# EAGLE design 89c2051-lk-ps2 (EAGLE 4.16)
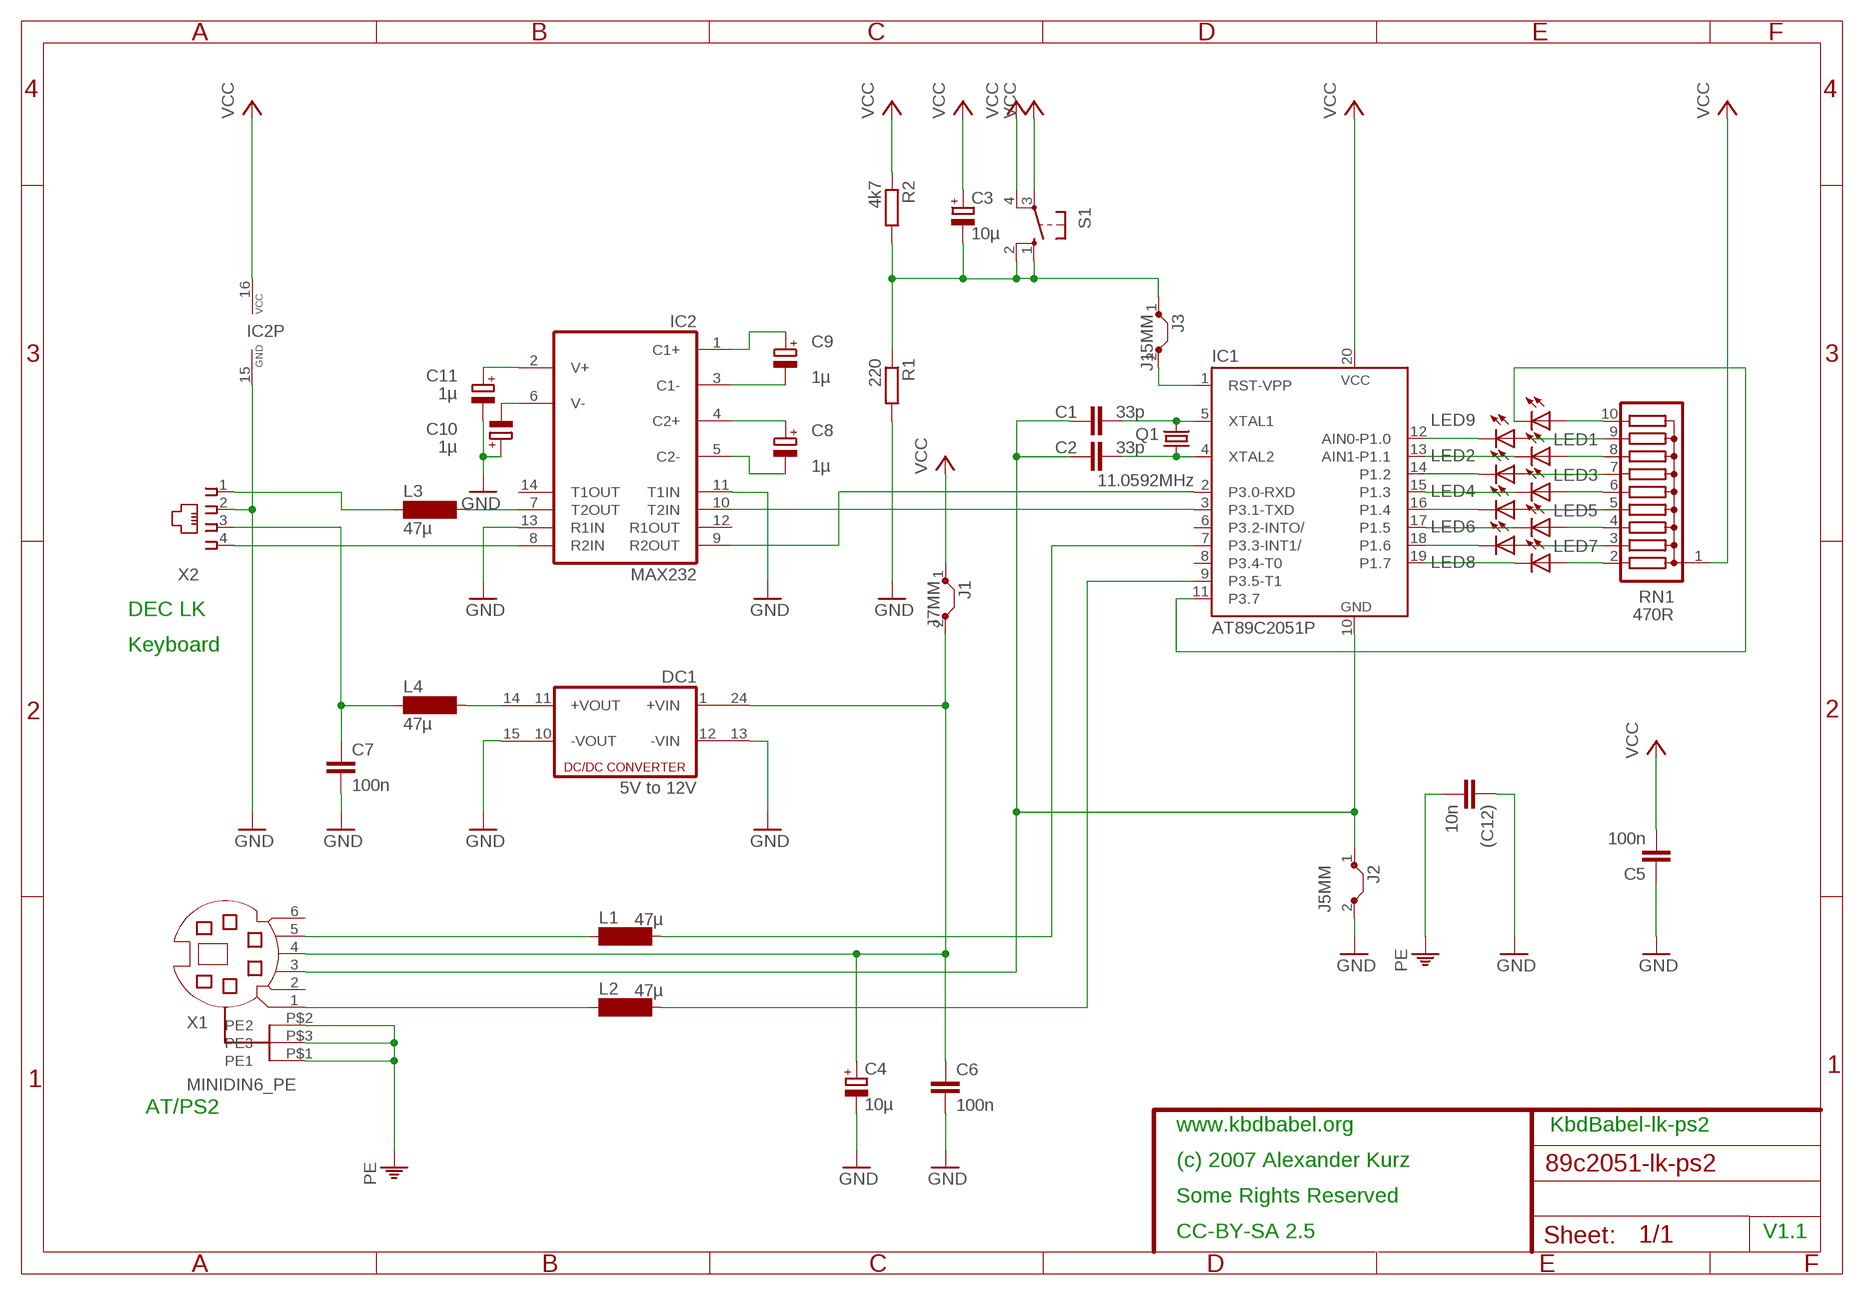
[diagram p0: schematic, sheet 1]

## Parts
(C12)  10n  C-EU025_050-025X075  [C025_050-025X075]
C1  33p  C-EU025-030X050  [C025-030X050]
C2  33p  C-EU025-030X050  [C025-030X050]
C3  10µ  CPOL-EUE2-5  [E2-5]
C4  10µ  CPOL-EUE2-5  [E2-5]
C5  100n  C-EU025_050-025X075  [C025_050-025X075]
C6  100n  C-EU025_050-025X075  [C025_050-025X075]
C7  100n  C-EU025_050-025X075  [C025_050-025X075]
C8  1µ  CPOL-EUE2-5  [E2-5]
C9  1µ  CPOL-EUE2-5  [E2-5]
C10  1µ  CPOL-EUE2-5  [E2-5]
C11  1µ  CPOL-EUE5-5  [E5-5]
DC1  5V to 12V  DC213R  [CMK]
IC1  AT89C2051P  [DIL20]
IC2  MAX232  [DIL16]
J1  J7MM  [07]
J2  J5MM  [05]
J3  J15MM  [15]
L1  47µ  SD75  [SD75]
L2  47µ  SD75  [SD75]
L3  47µ  SD75  [SD75]
L4  47µ  SD75  [SD75]
LED1  LEDSQR2X5  [LED2X5]
LED2  LEDSQR2X5  [LED2X5]
LED3  LEDSQR2X5  [LED2X5]
LED4  LEDSQR2X5  [LED2X5]
LED5  LEDSQR2X5  [LED2X5]
LED6  LEDSQR2X5  [LED2X5]
LED7  LEDSQR2X5  [LED2X5]
LED8  LEDSQR2X5  [LED2X5]
LED9  LEDSQR2X5  [LED2X5]
Q1  11.0592MHz  CRYSTALHC49U70  [HC49U70]
R1  220  R-EU_0204/7  [0204/7]
R2  4k7  R-EU_0204/7  [0204/7]
RN1  470R  G09R  [SIL10]
S1  10-XX  [B3F-10XX]
X1  MINIDIN6_PE  [MINIDIN6_PE]
X2  520249-2  [520249-2]

## Nets
GND: (C12).1 C4.- C5.1 C6.2 C7.2 C10.+ C11.- DC1.13(-VIN1) DC1.15(-VOUT1) IC2.11(T1IN) IC2.13(R1IN) IC2.15(GND) J2.2 R1.2 X2.2
GND_2: C1.1 C2.2 IC1.10(GND) J2.1 X1.3
N$1: C1.2 IC1.5(XTAL1) Q1.2
N$2: C2.1 IC1.4(XTAL2) Q1.1
N$3: IC2.7(T2OUT) L3.2
N$4: LED1.A RN1.9
N$5: IC1.17(P1.5) LED6.K(C)
N$6: IC1.2(P3.0-RXD) IC2.9(R2OUT)
N$7: IC2.8(R2IN) X2.4
N$8: IC1.12(AIN0-P1.0) LED1.K(C)
N$9: L3.1 X2.1
N$11: L2.1 X1.1
N$12: IC1.9(P3.5-T1) L2.2
N$13: IC1.13(AIN1-P1.1) LED2.K(C)
N$14: LED3.A RN1.7
N$15: IC1.15(P1.3) LED4.K(C)
N$16: LED5.A RN1.5
N$17: LED2.A RN1.8
N$18: LED4.A RN1.6
N$19: LED6.A RN1.4
N$20: IC1.18(P1.6) LED7.K(C)
N$21: LED8.A RN1.2
N$22: LED7.A RN1.3
N$23: IC1.19(P1.7) LED8.K(C)
N$24: IC1.16(P1.4) LED5.K(C)
N$25: IC1.14(P1.2) LED3.K(C)
N$26: DC1.14(+VOUT1) L4.2
N$27: LED9.A RN1.10
N$28: IC1.11(P3.7) LED9.K(C)
N$29: C7.1 L4.1 X2.3
N$30: C8.+ IC2.4(C2+)
N$31: C8.- IC2.5(C2-)
N$33: C9.- IC2.3(C1-)
N$34: C9.+ IC2.1(C1+)
N$35: C10.- IC2.6(V-)
N$36: C11.+ IC2.2(V+)
N$39: IC1.3(P3.1-TXD) IC2.10(T2IN)
N$41: IC1.7(P3.3-INT1/) L1.2
N$42: L1.1 X1.5
PE: (C12).2 X1.P$1(PE1) X1.P$2(PE2) X1.P$3(PE3)
RST: C3.- J3.1 R1.1 R2.2 S1.1(S) S1.2(S1)
RST_2: IC1.1(RST-VPP) J3.2
VCC: C3.+ C5.2 IC1.20(VCC) IC2.16(VCC) J1.1 R2.1 RN1.1 S1.3(P) S1.4(P1)
VCC_IN: C4.+ C6.1 DC1.24(+VIN1) J1.2 X1.4
Unconnected: DC1.1(+VIN) DC1.10(-VOUT) DC1.11(+VOUT) DC1.12(-VIN) IC1.6(P3.2-INTO/) IC1.8(P3.4-T0) IC2.12(R1OUT) IC2.14(T1OUT) X1.2 X1.6

## Notes on the sheet
- DEC LK
- Keyboard
- AT/PS2
- www.kbdbabel.org | KbdBabel-lk-ps2
- (c) 2007 Alexander Kurz
- Some Rights Reserved
- CC-BY-SA 2.5 | V1.1

## Library data of the parts
(C12) C1 C2 C5-C7 = rcl:C-EU: CAPACITOR, European symbol
C3 C4 C8-C11 = rcl:CPOL-EU: POLARIZED CAPACITOR, European symbol
DC1 = dc-dc-converter:DC213R: DC-DC CONVERTER
IC1 = atmel:AT89C2051: 80C31 MICROCONTROLLER 2 Kbytes FLASH 2.7 V
IC2 = maxim:MAX232: RS232 TRANSEIVER
J1-J3 = jumper:J: Bridge
L1-L4 = inductor-neosid:SD75: INDUCTOR nominal inductance, E12
LED1-LED9 = led:LED: LED OSRAM: - CHIPLED LG R971, LG N971, LY N971, LG Q971, LY Q971, LO R971, LY R971 LH N974, LH R974 LS Q976, LO Q976, LY Q976 LO Q996 - Hyper CHIPLED LW Q18S LB Q993, LB Q99A, LB R99A - SideLED LS A670, LO A670, LY A670, LG A670, LP A670 LB A673, LV A673, LT A673, LW A673 LH A674 LY A675 LS A676, LA A676, LO A676, LY A676, LW A676 LS A679, LY A679, LG A679 - Hyper Micro SIDELED® LS Y876, LA Y876, LO Y876, LY Y876 LT Y87S - SmartLED LW L88C, LW L88S LB L89C, LB L89S, LG L890 LS L89K, LO L89K, LY L89K LS L896, LA L896, LO L896, LY L896 - TOPLED LS T670, LO T670, LY T670, LG T670, LP T670 LSG T670, LSP T670, LSY T670, LOP T670, LYG T670 LG T671, LOG T671, LSG T671 LB T673, LV T673, LT T673, LW T673 LH T674 LS T676, LA T676, LO T676, LY T676, LB T676, LH T676, LSB T676, LW T676 LB T67C, LV T67C, LT T67C, LS T67K, LO T67K, LY T67K, LW E67C LS E67B, LA E67B, LO E67B, LY E67B, LB E67C, LV E67C, LT E67C LW T67C LS T679, LY T679, LG T679 LS T770, LO T770, LY T770, LG T770, LP T770 LB T773, LV T773, LT T773, LW T773 LH T774 LS E675, LA E675, LY E675, LS T675 LS T776, LA T776, LO T776, LY T776, LB T776 LHGB T686 LT T68C, LB T68C - Hyper Mini TOPLED® LB M676 - Mini TOPLED Santana® LG M470 LS M47K, LO M47K, LY M47K Source: http://www.osram.convergy.de - LUMILED® LXK2-PW12-R00, LXK2-PW12-S00, LXK2-PW14-U00, LXK2-PW14-V00 LXK2-PM12-R00, LXK2-PM12-S00, LXK2-PM14-U00 LXK2-PE12-Q00, LXK2-PE12-R00, LXK2-PE12-S00, LXK2-PE14-T00, LXK2-PE14-U00 LXK2-PB12-K00, LXK2-PB12-L00, LXK2-PB12-M00, LXK2-PB14-N00, LXK2-PB14-P00, LXK2-PB14-Q00 LXK2-PR12-L00, LXK2-PR12-M00, LXK2-PR14-Q00, LXK2-PR14-R00 LXK2-PD12-Q00, LXK2-PD12-R00, LXK2-PD12-S00 LXK2-PH12-R00, LXK2-PH12-S00 LXK2-PL12-P00, LXK2-PL12-Q00, LXK2-PL12-R00 Source: www.luxeon.com
Q1 = crystal:CRYSTAL: CRYSTAL
R1 R2 = rcl:R-EU_: RESISTOR, European symbol
RN1 = resistor-sil:G09R: SIL RESISTOR
S1 = switch-omron:10-XX: OMRON SWITCH
X1 = bla:MINIDIN6_PE
X2 = con-amp:520249-2: AMP connector

## Board
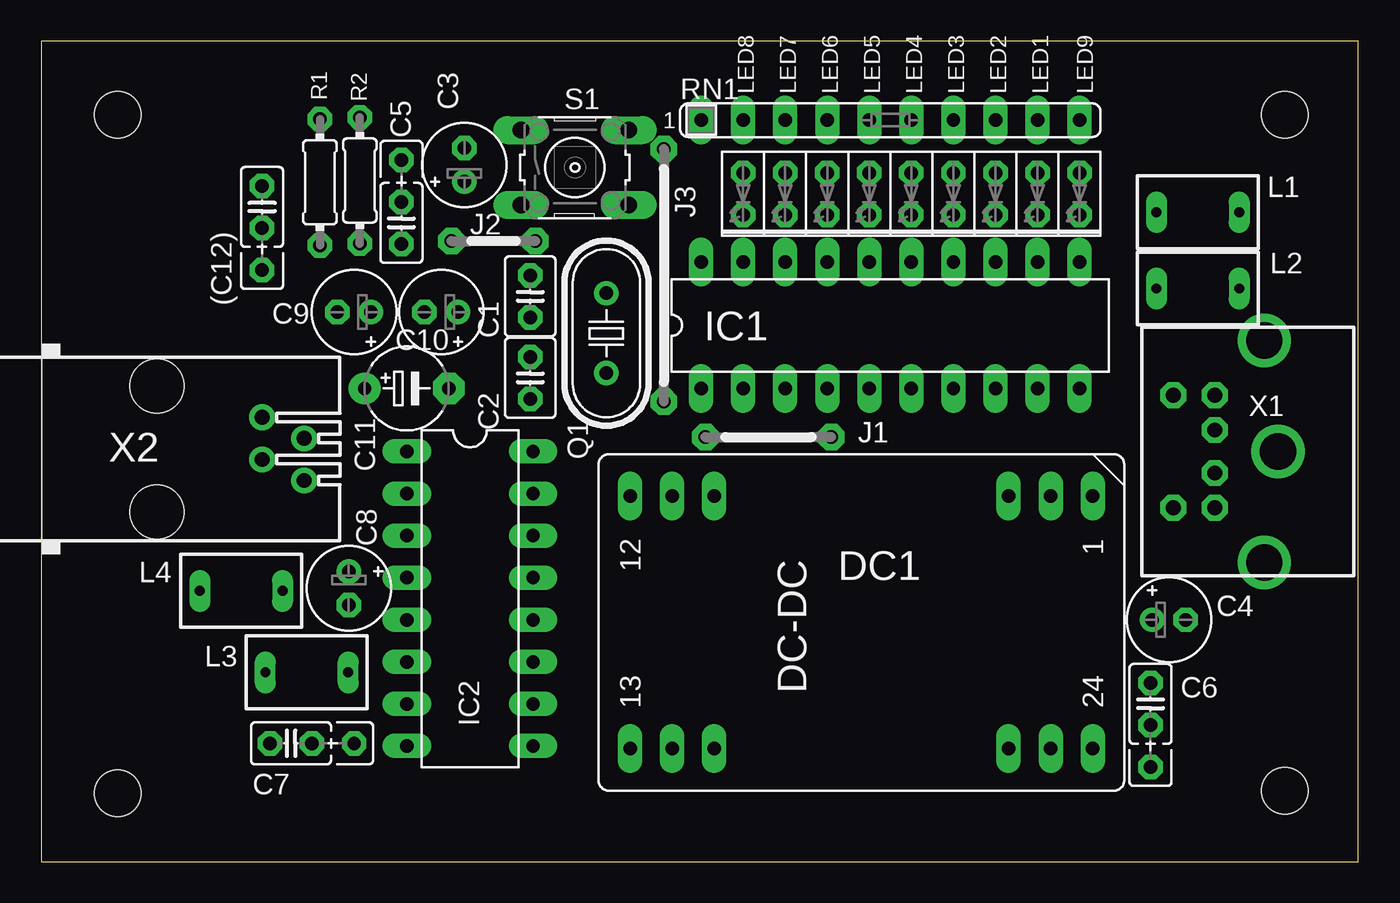
[diagram p1: board, top side]
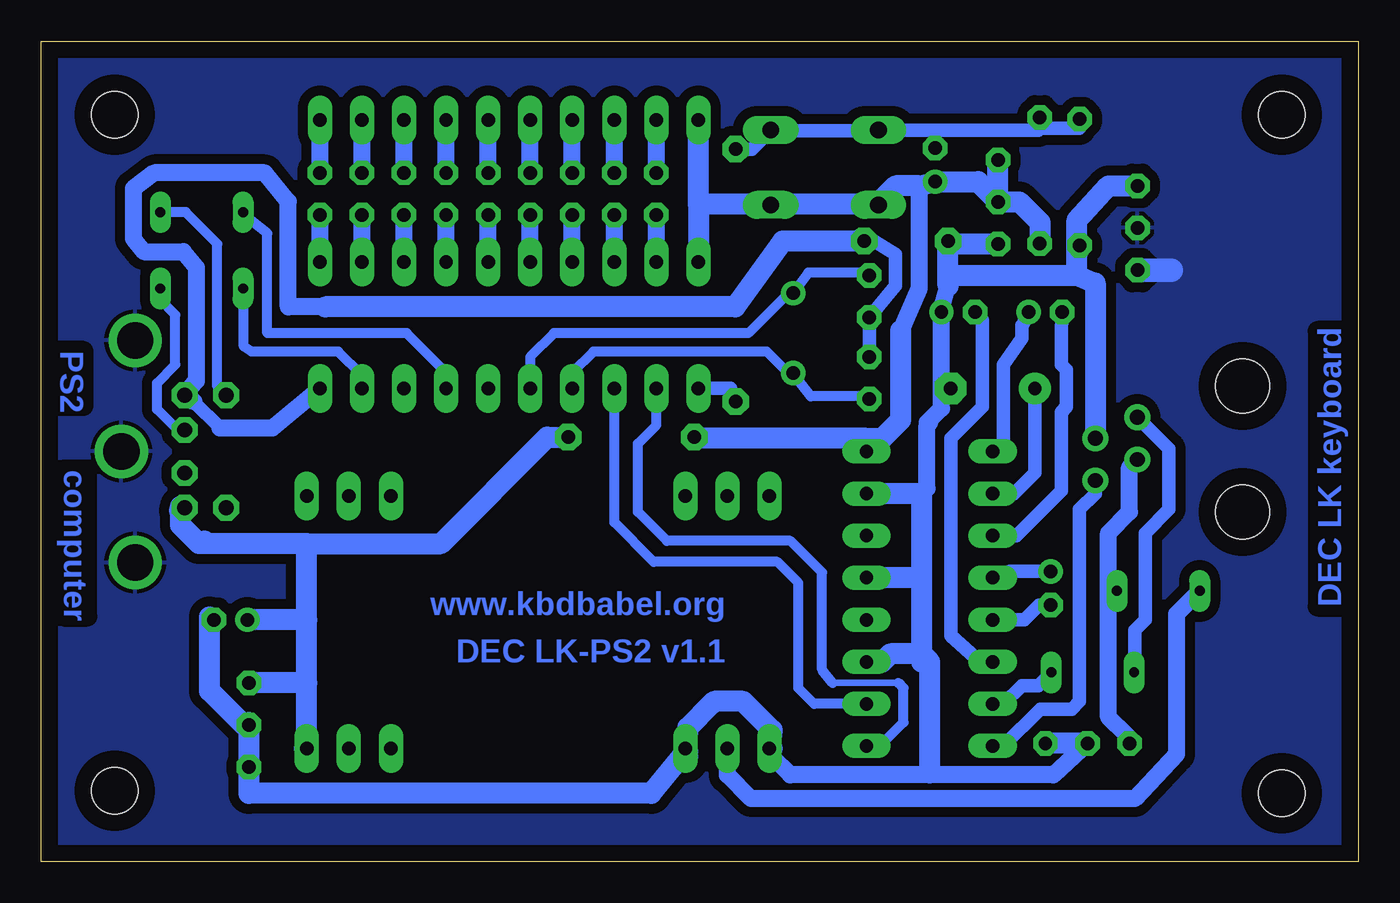
[diagram p2: board, bottom side, seen from below]

Size 79.52 x 49.52 mm. Coordinates in mm from the lower left corner, seen from the top.
Outline: 79.52,0 79.52,49.52 0,49.52 0,0 79.52,0
Copper layers (1*16): Top 0.035mm / dielectric 1.5mm / Bottom 0.035mm
Design rules "default": minimum track width 16mil, minimum drill 24mil, track to track 16mil, track to pad 16mil, pad to pad 16mil, via to via 16mil, smd to smd 16mil, copper to edge 40mil, drill to drill 8mil, minimum pad ring 13mil, minimum via ring 8mil, stop-mask expansion 4mil, vias tented up to drill 0mil, thermal gap 10mil
Holes 2.8 mm at 75.08,4.28 75.08,45.08 4.6,45.08 4.6,4.12

### Footprints (pad centres in the part's own frame; a part is rotated, then mirrored left to right if it is on the bottom)
C025_050-025X075 = drill 0.813 octagon: 1 -1.27,0; 2 1.27,0; 3 3.81,0
C025-030X050 = drill 0.813 octagon: 1 -1.27,0; 2 1.27,0
E2-5 = drill 0.813 pad 1.27 round: + -1.016,0 | drill 0.813 pad 1.27 octagon: - 1.016,0
E5-5 = drill 0.813 pad 1.905 round: + -2.54,0 | drill 0.813 pad 1.905 octagon: - 2.54,0
CMK = drill 0.813 long: 1 -7.62,13.97; 2 -7.62,11.43; 3 -7.62,8.89; 10 -7.62,-8.89; 11 -7.62,-11.43; 12 -7.62,-13.97; 13 7.62,-13.97; 14 7.62,-11.43; 15 7.62,-8.89; 22 7.62,8.89; 23 7.62,11.43; 24 7.62,13.97
DIL20 = drill 0.813 long: 1 -11.43,-3.81; 2 -8.89,-3.81; 3 -6.35,-3.81; 4 -3.81,-3.81; 5 -1.27,-3.81; 6 1.27,-3.81; 7 3.81,-3.81; 8 6.35,-3.81; 9 8.89,-3.81; 10 11.43,-3.81; 11 11.43,3.81; 12 8.89,3.81; 13 6.35,3.81; 14 3.81,3.81; 15 1.27,3.81; 16 -1.27,3.81; 17 -3.81,3.81; 18 -6.35,3.81; 19 -8.89,3.81; 20 -11.43,3.81
DIL16 = drill 0.813 long: 1 -8.89,-3.81; 2 -6.35,-3.81; 3 -3.81,-3.81; 4 -1.27,-3.81; 5 1.27,-3.81; 6 3.81,-3.81; 7 6.35,-3.81; 8 8.89,-3.81; 9 8.89,3.81; 10 6.35,3.81; 11 3.81,3.81; 12 1.27,3.81; 13 -1.27,3.81; 14 -3.81,3.81; 15 -6.35,3.81; 16 -8.89,3.81
07 = drill 0.813 pad 1.6 octagon: 1 -3.81,0; 2 3.81,0
05 = drill 0.813 pad 1.6 octagon: 1 -2.54,0; 2 2.54,0
15 = drill 0.813 pad 1.6 octagon: 1 -7.62,0; 2 7.62,0
SD75 = drill 0.6 long: 1 -2.5,0; 2 2.5,0
LED2X5 = drill 0.813 octagon: A -1.27,0; K 1.27,0
HC49U70 = drill 0.813 round: 1 -2.413,0; 2 2.413,0
0204/7 = drill 0.813 octagon: 1 -3.81,0; 2 3.81,0
SIL10 = drill 0.813 long: 1 -11.43,0; 2 -8.89,0; 3 -6.35,0; 4 -3.81,0; 5 -1.27,0; 6 1.27,0; 7 3.81,0; 8 6.35,0; 9 8.89,0; 10 11.43,0
B3F-10XX = drill 1.016 long: 1 -3.251,2.261; 2 3.251,2.261; 3 -3.251,-2.261; 4 3.251,-2.261
MINIDIN6_PE = drill 0.9 octagon: 1 1.3,2.15; 2 -1.3,2.15; 3 3.4,2.15; 4 -3.4,2.15; 5 3.4,4.65; 6 -3.4,4.65 | drill 2.2 round: P$1 0,-1.676; P$2 -6.706,-0.838; P$3 6.706,-0.838
520249-2 = drill 0.889 round: 1 -1.905,6.35; 2 -0.635,8.89; 3 0.635,6.35; 4 1.905,8.89 | hole 3.251: -3.81,0; 3.81,0

### Placement (x,y rotation side)
(C12)  13.33,39.52 270 top
C1  29.52,34.12 90 top
C2  29.52,29.2 90 top
C3  25.55,42.06 90 top
C4  68.1,14.6 0 top
C5  21.74,38.56 90 top
C6  66.99,9.52 270 top
C7  15.08,7.14 0 top
C8  18.57,16.5 270 top
C9  18.89,33.17 180 top
C10  24.15,33.17 180 top
C11  22.06,28.57 0 top
DC1  49.52,14.44 270 top
IC1  51.27,32.38 0 top
IC2  25.88,15.87 270 top
J1  43.91,25.62 0 top
J2  27.3,37.46 180 top
J3  37.59,35.39 270 top
L1  69.84,39.21 180 top
L2  69.84,34.6 180 top
L3  16.03,11.42 0 top
L4  12.06,16.34 180 top
LED1  60.16,40.32 270 top
LED2  57.62,40.32 270 top
LED3  55.08,40.32 270 top
LED4  52.54,40.32 270 top
LED5  50,40.32 270 top
LED6  47.46,40.32 270 top
LED7  44.92,40.32 270 top
LED8  42.38,40.32 270 top
LED9  62.7,40.32 270 top
Q1  34.13,31.9 90 top
R1  16.82,41.01 270 top
R2  19.23,41.12 90 top
RN1  51.27,44.76 0 top
S1  32.22,41.9 0 top
X1  73.02,24.76 90 top
X2  6.98,24.92 270 top

### Tracks (layer width: path | path; a pad name or v marks a point on that pad's centre or on a via)
GND
  Bottom 1.016: 35.4,7.93 35.4,6.34 34.28,5.23 | 34.28,5.23 | 25.87,5.23 18.41,5.23 C7.2 16.35,6.98 C7.2 | 25.87,5.23 34.28,5.23 | 25.95,26.43 26.03,26.35 26.03,22.54 26.35,22.22 | 25.95,26.43 25.87,26.5 | 25.87,5.23 25.87,5.87 | 25.39,33.17 | C10.+ 25.39,33.17 | 25.95,26.43 26.03,26.5 25.17,27.37 25.17,28.57 | 25.95,26.43 | 25.17,28.57 C10.+ | 25.17,28.57 C11.- | C10.+ 25.24,33.17 24.76,34.76
  Bottom 1.27: 35.4,6.82 DC1.13 35.4,7.93 37.14,9.68 38.89,9.68 39.05,9.52 | 39.05,9.52 | 39.05,9.52 40.48,8.09 DC1.15 | DC1.15 40.48,6.66 | 16.98,36.66 | 16.98,36.66 R1.2 16.98,36.73 16.98,35.39 | (C12).1 | 16.98,36.66 16.98,38.73 15.08,40.79 (C12).1 | 40.63,6.66 40.48,6.34 | DC1.15 40.63,6.66 | 40.63,6.66 42.7,4.12 66.99,4.12 C6.2 | J2.2 24.6,37.46 24.76,37.3 24.76,35.39 | 24.76,34.76 24.76,35.39 | C6.2 66.99,8.41 | C6.2 | C6.2 67.3,8.25 69.37,10.31 69.37,14.76 | 69.37,14.76 | 69.37,14.76 C4.- | 25.87,5.87 25.87,12.06 | 25.87,12.06 26.35,12.06 | 26.35,12.06 | 26.35,12.06 26.35,17.14 | 26.35,17.14 26.35,22.22 | 29.68,22.22 | 29.68,22.22 IC2.15 | 26.35,22.22 29.68,22.22 | 29.68,22.22 | IC2.13 26.35,17.14 | IC2.11 28.73,12.06 28.25,12.53 26.35,12.53 25.87,12.06 | C7.2 18.89,7.14 | X2.2 15.87,34.92 16.98,35.39 | 24.76,35.39 16.98,35.39 | J2.2 | C5.1 24.59,37.29 J2.2
GND_2
  Bottom 0.813: C1.1 29.84,33.01 | C1.1 C2.2 | C1.1 27.93,34.76 27.93,36.66 29.2,37.46 J2.1 | 70.32,27.77 68.73,26.19
  Bottom 1.016: 62.38,33.49 | 66.03,41.59 | 66.03,41.59 72.7,41.59 73.97,40.63 73.97,37.62 73.34,36.82 70.96,36.82 70.16,35.87 70.16,29.02 X1.3 70.8,28.09 70.32,27.77 | IC1.10 65.56,26.19 68.73,26.19 | 62.38,33.49 64.61,33.49 64.61,39.84 66.03,41.59
  Bottom 1.27: J2.1 30,37.62 J2.1 | 62.38,33.49 37.62,33.49 34.76,37.46 J2.1 | J2.1
N$1
  Bottom 0.61: C1.2 29.84,35.55 33.21,35.55 Q1.2 34.44,34.28 36.82,31.9 48.57,31.9 50,30.47 IC1.5 | IC1.5
N$2
  Bottom 0.61: C2.1 29.84,28.09 33.05,28.09 Q1.1 34.44,29.52 35.71,30.79 46.19,30.79 47.46,29.52 IC1.4 | IC1.4
N$3
  Bottom 0.813: L3.2 19.32,10.63 20.31,10.63 21.43,9.52 22.55,9.52 IC2.7
N$4
  Bottom 1.016: LED1.A RN1.9
N$5
  Bottom 1.016: IC1.17 LED6.K
N$6
  Bottom 0.406: 27.78,10.79 31.74,10.79
  Bottom 0.61: IC1.2 42.38,26.35 43.49,25.23 43.49,21.11 41.75,19.36 34.28,19.36 32.38,17.46 32.38,11.58 31.74,10.79 | 27.78,10.79 27.46,10.47 27.46,8.41 29.05,6.82 30,6.82 29.84,6.98 IC2.9
N$7
  Bottom 0.813: IC2.8 21.43,6.98 19.2,9.2 17.3,9.2 16.82,9.68 16.82,21.27 15.87,22.22 X2.4 | X2.4
N$8
  Bottom 1.016: IC1.12 LED1.K
N$9
  Bottom 0.813: X2.1 11.42,24.92 11.42,21.27 12.85,19.84 12.85,14.6 13.49,13.96 13.49,11.38
  Bottom 1.016: 13.49,11.26 13.49,11.38 L3.1
N$11
  Bottom 0.61: L2.1 72.38,34.56 72.38,33.97 71.43,33.01 71.43,30 72.54,28.89 72.54,27.3 71.27,26.03 70.9,26.03 X1.1
N$12
  Bottom 0.61: IC1.9 | IC1.9 60.16,29.36 61.59,30.79 66.83,30.79 67.3,31.11 67.3,34.6 L2.2 | L2.2
N$13
  Bottom 1.016: IC1.13 LED2.K
N$14
  Bottom 1.016: LED3.A RN1.7
N$15
  Bottom 1.016: IC1.15 LED4.K
N$16
  Bottom 1.016: LED5.A RN1.5
N$17
  Bottom 1.016: LED2.A RN1.8
N$18
  Bottom 1.016: LED4.A RN1.6 LED4.A
N$19
  Bottom 1.016: LED6.A RN1.4 LED6.A
N$20
  Bottom 1.016: IC1.18 LED7.K
N$21
  Bottom 1.016: LED8.A RN1.2
N$22
  Bottom 1.016: LED7.A RN1.3
N$23
  Bottom 1.016: IC1.19 LED8.K
N$24
  Bottom 1.016: IC1.16 LED5.K
N$25
  Bottom 1.016: IC1.14 LED3.K
N$26
  Bottom 1.016: L4.2 10.95,14.96 10.95,6.5 13.49,3.8 36.67,3.8 38.09,5.23 DC1.14 | DC1.14
N$27
  Bottom 1.016: LED9.A RN1.10
N$28
  Bottom 1.016: IC1.11 LED9.K
N$29
  Bottom 1.016: X2.3 13.81,23.81 13.81,21.11 15.08,19.84 15.08,16.5 | 15.08,16.5 15.08,8.72 13.96,7.61 13.96,7.14 C7.1 | 15.08,16.5 L4.1
N$30
  Bottom 0.813: C8.+ 21.04,17.52 21.43,17.14 21.9,17.14 IC2.4
N$31
  Bottom 0.813: C8.- 19.27,15.49 20.16,14.6 22.06,14.6 IC2.5
N$33
  Bottom 0.813: C9.- 17.93,32.16 17.93,30 17.62,29.68 17.62,27.46 17.93,27.14 17.93,22.38 20.63,19.68 22.06,19.68 IC2.3
N$34
  Bottom 0.813: IC2.1 21.43,24.93 21.43,30 20.31,31.58 20.31,32.28 | 20.31,32.28 20.31,32.38 | 20.31,32.28 C9.+
N$35
  Bottom 0.61: 23.33,26.82 | 23.17,33.17
  Bottom 0.813: IC2.6 22.85,12.06 24.6,13.65 24.6,25.55 23.33,26.82 22.7,27.46 22.7,32.7 23.17,33.17 C10.-
N$36
  Bottom 0.813: C11.+ 19.52,23.49 20.79,22.22 22.06,22.22 IC2.2
N$39
  Bottom 0.61: IC1.3 44.92,20.47 42.54,18.09 35.08,18.09 33.81,16.82 33.81,10.47 32.86,9.52 30,9.52 29.84,9.68 IC2.10
N$41
  Bottom 0.61: IC1.7 55.08,29.52 57.46,31.9 65.88,31.9 65.88,37.93 67.3,39.05 67.3,39.2 L1.2
N$42
  Bottom 0.61: X1.5 68.89,28.68 68.89,37.3 70.8,39.2 L1.1 | L1.1 72.38,39.2 | L1.1
PE
  Bottom 1.422: 11.27,35.71 13.33,35.71
  pour Bottom (isolate 0.61): 79.69,-0.17 79.69,49.68 -0.16,49.68 -0.16,-0.17
RST
  Bottom 0.813: S1.1 28.92,44.16 28.89,44.13 | 19.2,44.28 19.22,44.3 R2.2 | 25.55,44.16 19.32,44.16 19.2,44.28 | 25.55,44.16 S1.1 | R1.1 16.82,44.28 19.2,44.28 | 25.55,44.16 25.55,44.13 C3.- | 35.51,44.13 35.55,44.13 | 35.51,44.13 S1.2 36.62,43.01 J3.1 | S1.1 29.01,44.13 35.51,44.13 | J3.1 37.78,43.01 | J3.1
RST_2
  Bottom 0.813: IC1.1 | J3.2 37.91,28.57 IC1.1
VCC
  Bottom 1.016: 27.62,32.06 26.51,34.6 26.51,40.63 | 26.51,40.63 26.51,40.79 | 26.51,40.63
  Bottom 1.27: J1.1 39.87,25.55 29.68,25.55 | IC2.16 29.68,24.76 29.68,25.55 | IC2.16 | 29.68,25.55 28.73,25.55 27.62,26.66 27.62,32.06 | 39.84,39.68 IC1.20 | 39.84,39.68 RN1.1 | 35.47,39.68 S1.4 | 29.05,39.68 28.97,39.68 S1.3 29.01,39.64 29.05,39.68 | 29.05,39.68 35.47,39.68 | 35.47,39.68 39.84,39.68 | 29.05,39.68 27.93,40.79 26.51,40.79 C3.+ 22.95,41.05 21.74,39.84 | 21.74,39.84 C5.2 20.46,39.83 19.2,38.57 19.23,38.54 R2.1 | 21.74,39.84 | 21.74,39.84 | 21.74,39.84 21.58,40 | 21.74,39.84 21.74,42.38
VCC_IN
  Bottom 1.27: J1.2 48.98,25.62 55.4,19.2 63.49,19.2 | 63.49,19.2 69.69,19.2 | 69.69,19.2 70,19.2 71.11,20.31 71.11,21.42 71.19,21.19 X1.4 | 63.65,6.82 63.49,6.98 63.49,10.79 | 63.49,10.79 63.49,14.6 | 63.49,14.6 63.49,19.2 | DC1.24 63.65,6.82 | 63.65,6.82 | 69.69,19.2 69.69,19.36 | 63.49,10.79 C6.1 | 63.49,14.6 C4.+

### Text on the board
Bottom: PS2 | computer | www.kbdbabel.org | DEC LK keyboard | DEC LK-PS2 v1.1